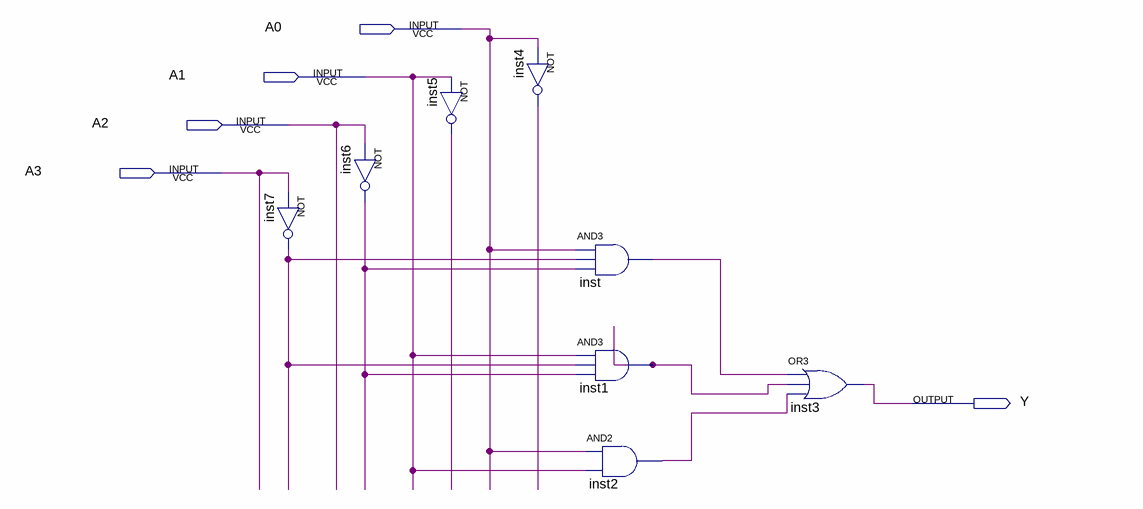
[diagram p0: schematic sheet]
// Quartus schematic Segment5.bdf as structural Verilog: 8 symbols, 5 pins
module Segment5 (
  input  A0,
  input  A1,
  input  A2,
  input  A3,
  output Y
);

  wire inst1_out, inst2_out, inst4_out, inst5_out, inst6_out, inst7_out, inst_out;

  not inst7 (inst7_out, A3);
  not inst6 (inst6_out, A2);
  not inst5 (inst5_out, A1);
  not inst4 (inst4_out, A0);
  and inst (inst_out, A0, inst7_out, inst6_out);
  and inst1 (inst1_out, A1, inst7_out, inst6_out);
  and inst2 (inst2_out, A0, A1);
  or inst3 (Y, inst_out, inst1_out, inst2_out);
endmodule
